# Altium schematic sheet MCU.SchDoc (part 2 of 3)
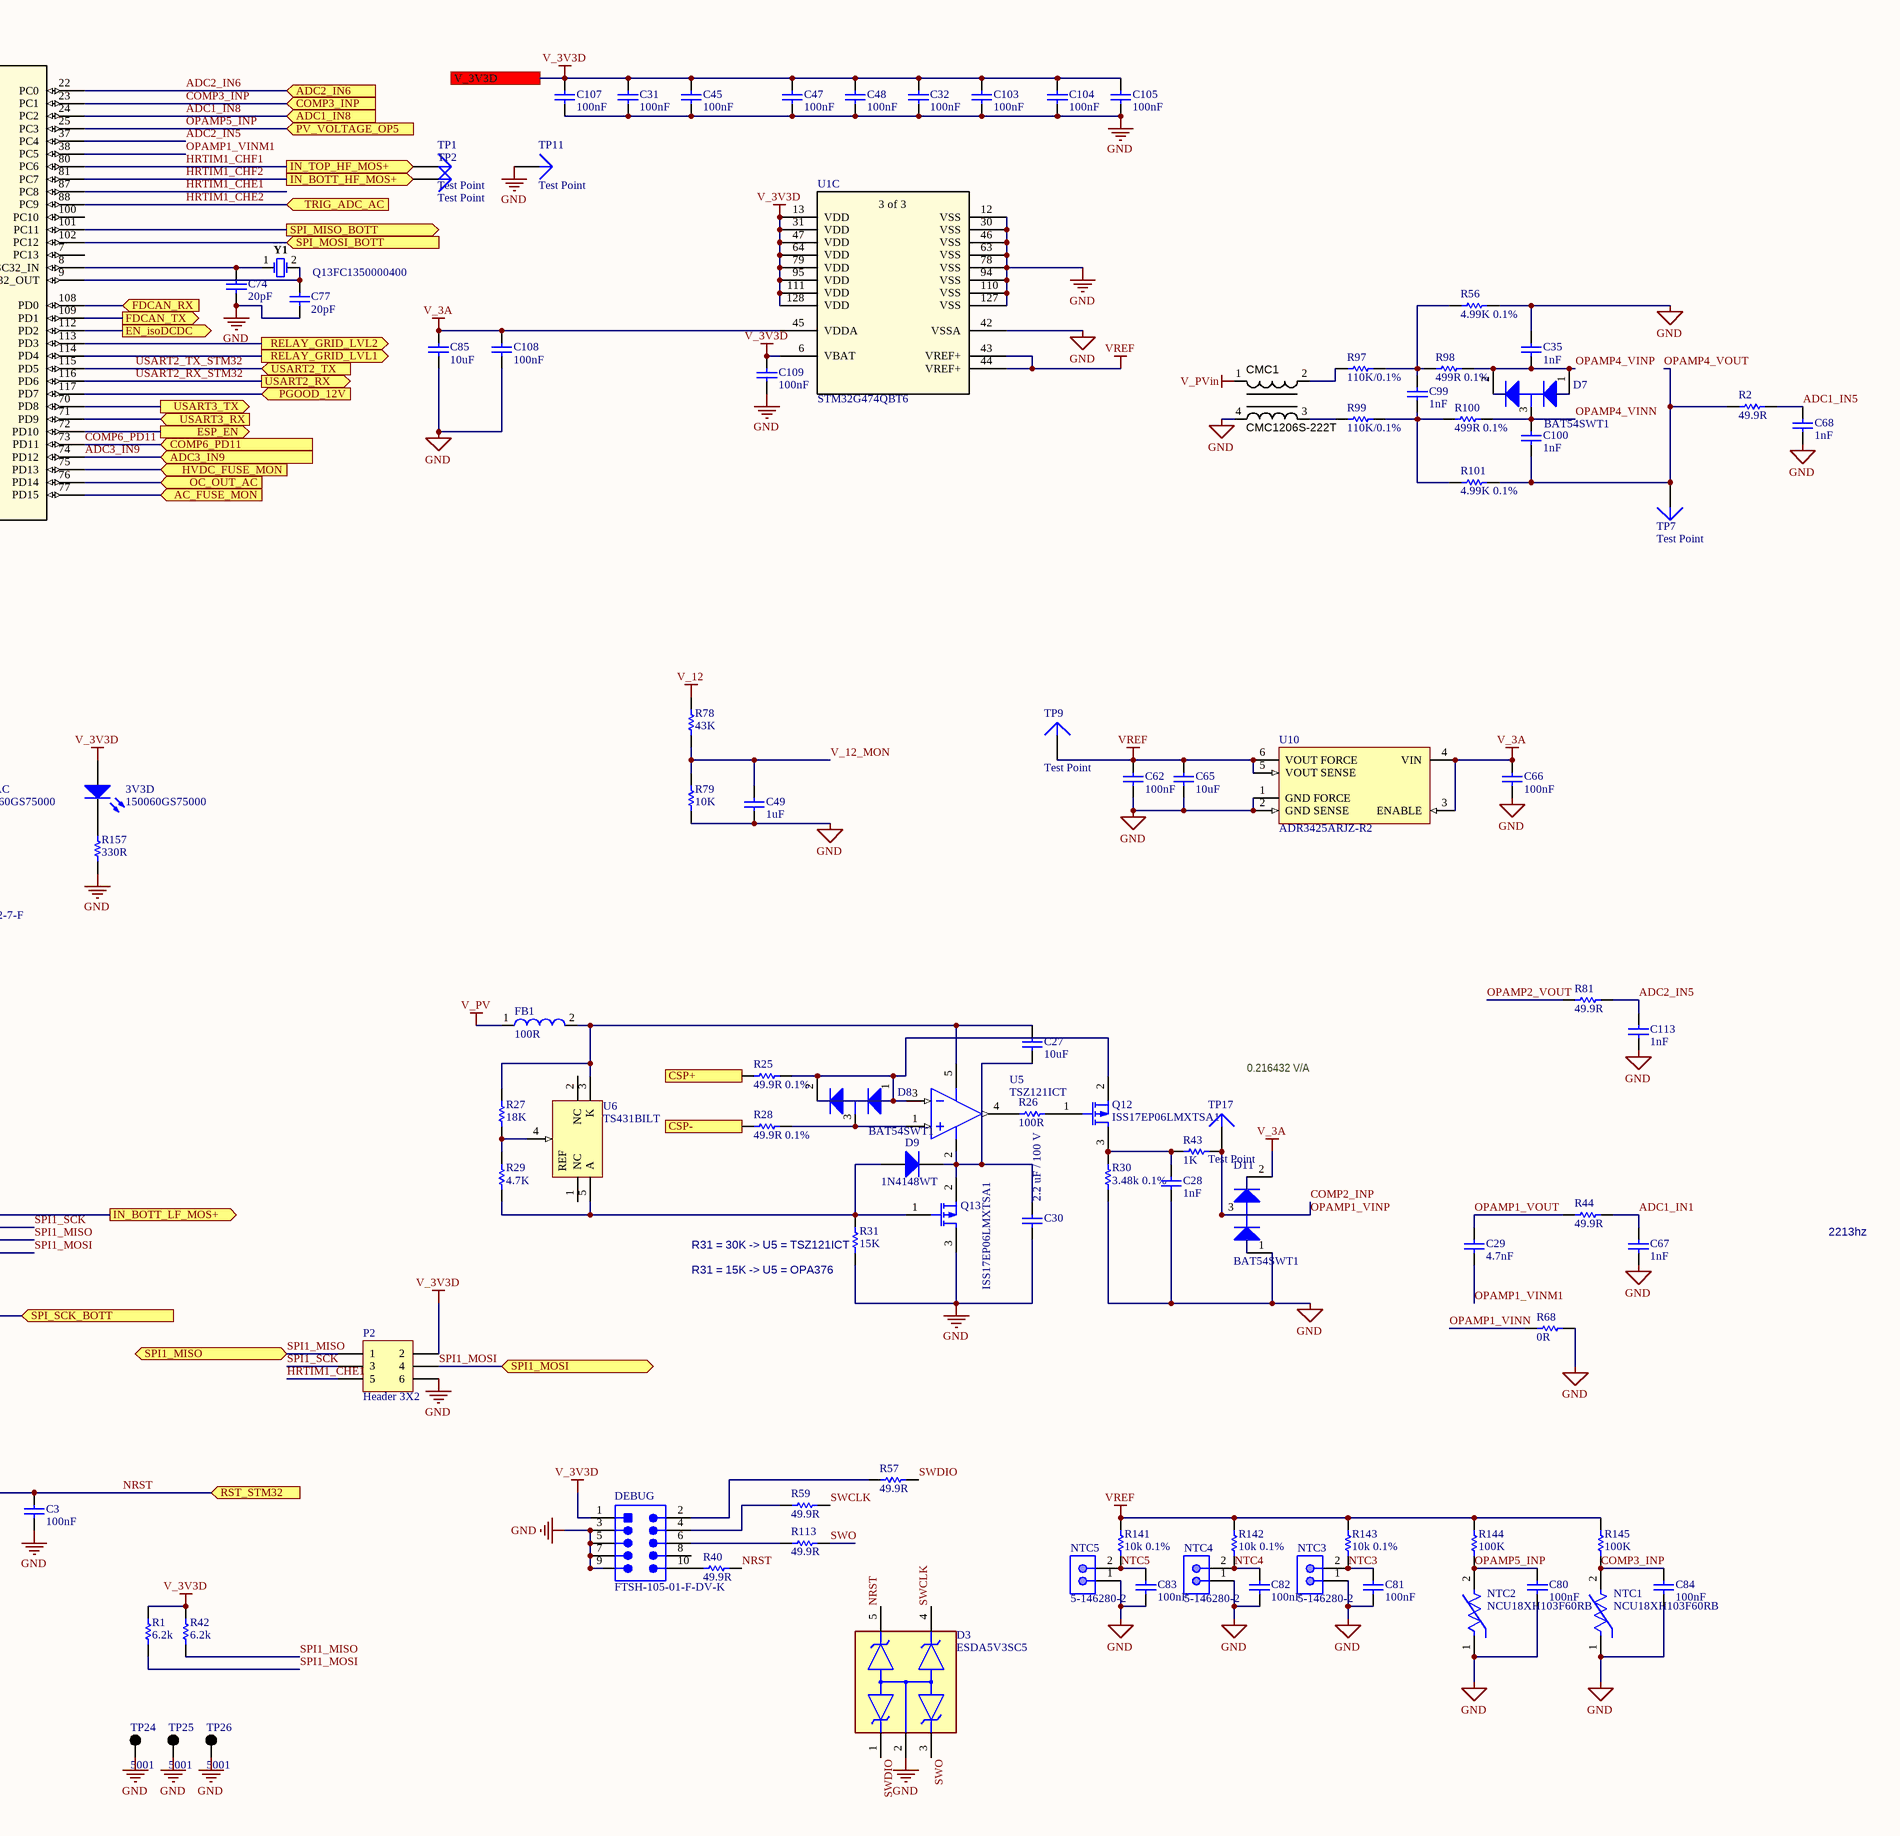
[diagram p2: MCU.SchDoc, right]
## Library data of the parts
3V3D DC/AC = CMP-1426-00002-1: SMD mono-color Chip LED, WL-SMCW, Green; Manufacturer: Wuerth Elektronik; ComponentLink1URL: http://www.we-online.com; ComponentLink2Description: Datasheet; Color: Green; ComponentLink2URL: http://katalog.we-online.com/led/datasheet/150060GS75000.pdf; PartNumber: 150060GS75000; PackageReference: 0603_A; ComponentLink1Description: Manufacturer URL; Parameter 1: *; JLCPCB Part #: *
C3 = CMP-2008-02743-1: X7R 100nF ±10% 16V 0402 Multilayer Ceramic Capacitors MLCC - SMD/SMT ROHS; Manufacturer: AVX Interconnect / Elco; Part Number: 04026D104KAT2A; Voltage Rating: 6.3V; Dielectric: X5R; Supplier 1: Newark; Supplier Part Number 1: 34M9214; Manufacturer Part Number: 04026D104KAT2A; RoHS: Yes; Category: Ceramic Capacitors; Stock 1: 1436; Pricing 1: 10=0.02800, 25=0.02300, 50=0.01800, 100=0.01200, 250=0.01100, 500=0.00900, 1000=0.00700 (USD); Mount: Surface Mount; Case/Package: 0402; Case Code (Metric): 1005; Case Code (Imperial): 0402; Contact Plating: Tin,Matte; Dielectric Material: Ceramic; Min Operating Temperature: -55°C; Max Operating Temperature: 85°C; Package Quantity: 1; Packaging: Tape and Reel; Capacitance: 100nF; Tolerance: 10%; Voltage Rating (DC): 6.3V; Voltage: 6.3V; Termination: SMD/SMT; Series: -; Construction: Flat; Length: 1mm; Width: 0.02inch; Height: 0.56mm; Thickness: 0.022inch; Depth: 0.5mm; Radiation Hardening: No; REACH SVHC: No SVHC; Lead Free: Lead Free; RoHS Compliant: Yes; Parameter 1: *; JLCPCB Part #: C1525
C27 C85 = CMP-2007-03395-1: X5R 25V ±10% 10uF 0805 Multilayer Ceramic Capacitors MLCC - SMD/SMT ROHS; Part Number: GRM21BR71A106KE51L; Manufacturer: Murata; Parameter 1: *; JLCPCB Part #: C15850
C28 C68 C99 C100 = CAP: X7R 1nF ±10% 50V 0603 Multilayer Ceramic Capacitors MLCC - SMD/SMT ROHS; Manufacturer: AVX Interconnect / Elco; Part Number: 06035A151JAT2A.; Manufacturer Part Number: 06035A151JAT2A; Capacitance: 100pF; Tolerance: 5%; Dielectric: C0G; Temperature Coefficient: 30ppm/°C; Insulation Resistance: 100GR; Supplier 1: Digi-Key; Supplier Part Number 1: 478-1177-1-ND; RoHS: Yes; Category: Ceramic Capacitors; Stock 1: 63714; Pricing 1: 1=0.12000, 10=0.08900, 100=0.04180, 500=0.02932, 1000=0.02428 (USD); Mount: Surface Mount,PCB; Case/Package: 0603; Number of Pins: 2; Case Code (Metric): 1608; Case Code (Imperial): 0603; Dielectric Material: Ceramic; Contact Plating: Tin,Matte; Min Operating Temperature: -55°C; Max Operating Temperature: 125°C; Voltage Rating (DC): 50V; Voltage Rating: 50V; Packaging: Tape and Reel; Package Quantity: 1; Termination: SMD/SMT; Voltage: 50V; Length: 1.6mm; Height: 0.86mm; Width: 0.032inch; Depth: 0.81mm; Thickness: 0.035inch; Radiation Hardening: No; Lead Free: Lead Free; REACH SVHC: No SVHC; ComponentLink1URL: https://datasheet.ciiva.com/1124/84496-1124721.pdf?src-supplier=Element14; ComponentLink1Description: https://datasheet.ciiva.com/1124/84496-1124721.pdf?src-supplier=Element14; ComponentLink2URL: https://datasheet.ciiva.com/2987/ccog-2987781.pdf?src-supplier=Avnet; ComponentLink2Description: https://datasheet.ciiva.com/2987/ccog-2987781.pdf?src-supplier=Avnet; ComponentLink3URL: https://datasheet.ciiva.com/7855/759117-7855061.pdf?src-supplier=Element14; ComponentLink3Description: https://datasheet.ciiva.com/7855/759117-7855061.pdf?src-supplier=Element14; ComponentLink4URL: https://datasheet.ciiva.com/2987/ccog-2987782.pdf?src-supplier=Avnet; ComponentLink4Description: https://datasheet.ciiva.com/2987/ccog-2987782.pdf?src-supplier=Avnet; ComponentLink5URL: https://datasheet.ciiva.com/156/ccog-156216.pdf?src-supplier=Digi-Key; ComponentLink5Description: https://datasheet.ciiva.com/156/ccog-156216.pdf?src-supplier=Digi-Key; ComponentLink6URL: https://datasheet.ciiva.com/156/ccog-156217.pdf?src-supplier=Digi-Key; ComponentLink6Description: https://datasheet.ciiva.com/156/ccog-156217.pdf?src-supplier=Digi-Key; ComponentLink7URL: https://datasheet.ciiva.com/156/ccog-156218.pdf?src-supplier=Digi-Key; ComponentLink7Description: https://datasheet.ciiva.com/156/ccog-156218.pdf?src-supplier=Digi-Key; ComponentLink8URL: https://datasheet.ciiva.com/16300/ccog-16300429.pdf?src-supplier=Future+Electronics; ComponentLink8Description: https://datasheet.ciiva.com/16300/ccog-16300429.pdf?src-supplier=Future+Electronics; ComponentLink9URL: https://datasheet.ciiva.com/22699/84496-22699966.pdf?src-supplier=Element14; ComponentLink9Description: https://datasheet.ciiva.com/22699/84496-22699966.pdf?src-supplier=Element14; ComponentLink10URL: https://datasheet.ciiva.com/5418/ccog-5418335.pdf?src-supplier=Mouser; ComponentLink10Description: https://datasheet.ciiva.com/5418/ccog-5418335.pdf?src-supplier=Mouser; ComponentLink11URL: https://datasheet.ciiva.com/16538/ccog-16538111.pdf?src-supplier=Avnet+Asia; ComponentLink11Description: https://datasheet.ciiva.com/16538/ccog-16538111.pdf?src-supplier=Avnet+Asia; Parameter 1: *; JLCPCB Part #: C1588
C29 = CMP-2000-07546-1: X7R ±10% 4.7nF 50V 0603 Multilayer Ceramic Capacitors MLCC - SMD/SMT ROHS; Manufacturer: TDK; Capacitance: 100nF; Package Reference: 603; Radiation Hardening: No; Composition: Ceramic; Datasheet URL: https://product.tdk.com/info/en/catalog/datasheets/mlcc_automotive_general_en.pdf; Mounting Technology: SurfaceMount; Datasheet Version: 12/2014; Width: 0.8mm; Length: 1.6mm; Voltage: 50V; Tolerance: 10%; Case Code (Imperial): 0603; RoHSCompliant: True; Min Operating Temperature: -55degC; Package Description: 2-Pin Surface Mount Device, Body 1.6 x 0.8 mm; Packaging: TapeandReel; Package Quantity: 1; Voltage Rating: 50V; Mount: SurfaceMount; Lead Free: LeadFree; Depth: 0.8mm; Termination: SMD/SMT; Case Code (Metric): 1608; Thickness: 0.035inch; Height: 0.8mm; Dielectric: X7R; Weight: 7.1E-05oz; Voltage Rating (DC): 50V; REACH SVHC: NoSVHC; Manufacturer URL: http://www.tdk.com/; Case/Package: 0603; Max Operating Temperature: 125degC; Parameter 1: *; JLCPCB Part #: C53987
C30 = CMP-2000-06053-1: Chip Capacitor, 2.2 uF, +/- 10%, -55 to 125 degC, 1210 (3225 Metric), RoHS, Tape and Reel; PCN Part Number: MLCCPartNumberChange30/Nov/2012; Manufacturer: TDK; Capacitance: 2.2µF; Catalog Drawings: CSERIES_1210_2.5; Product Training Modules: SEAT,CCV,andTVCLDesignToolsGuidetoReplacinganElectrolyticCapacitorwithanMLCC; Other Names: 445-4497-6; Voltage - Rated: 100V; Temperature Coefficient: X7R; Featured Product: C-SeriesMidVoltageMLCCs; Online Catalog: CSeries,MidVoltage; Ratings: -; Mounting Technology: SurfaceMount; Height - Seated (Max): -; Applications: GeneralPurpose; Packaging: Digi-Reel®; Mounting Type: SurfaceMount,MLCC; Lead Spacing: -; Thickness (Max): 0.098"(2.50mm); Package Reference: 1210 (3225 Metric); Manufacturer URL: http://www.tdk.com/; Size / Dimension: 0.126"Lx0.098"W(3.20mmx2.50mm); Operating Temperature: -55°C~125°C; Datasheet URL: https://datasheet.ciiva.com/15192/getdatasheetpartid-725361-15192330.pdf; RoHS Information: RoHSCertificate-MLCC; Lead Style: -; Standard Package: 1; Family: CeramicCapacitors; Datasheet Version: 10/2014; Category: Capacitors; Tolerance: ±10%; Features: -; Series: C; Package Description: 2-Pin Surface Mount Device, Body 3.2 x 2.5 mm; Package / Case: 1210(3225Metric); Parameter 1: *; JLCPCB Part #: *
C31 C32 C45 C47 C48 C66 C80-C84 C103-C105 C107-C109 = CAP: X7R 100nF ±10% 50V 0603 Multilayer Ceramic Capacitors MLCC - SMD/SMT ROHS; Part Number: GCM188R72A104KA64D; Manufacturer: Murata; Manufacturer Part Number: CC0603KRX7R9BB104; Voltage Rating: 100V; Supplier 1: Arrow Electronics; Supplier Part Number 1: GCM188R72A104KA64D; RoHS: Yes; Category: Ceramic Capacitors; Mount: Surface Mount; Case/Package: 0603; Case Code (Imperial): 0603; Case Code (Metric): 1608; Min Operating Temperature: -55°C; Max Operating Temperature: 125°C; Tolerance: 10%; Packaging: Tape and Reel; Capacitance: 100nF; Dielectric: X7R; Termination: SMD/SMT; Voltage Rating (DC): 100V; Length: 1.6mm; Height: 0.8mm; Depth: 0.8mm; Radiation Hardening: No; ComponentLink1URL: https://datasheet.ciiva.com/17451/product-17451047.pdf?src-supplier=Avnet+Europe; ComponentLink1Description: https://datasheet.ciiva.com/17451/product-17451047.pdf?src-supplier=Avnet+Europe; ComponentLink2URL: https://datasheet.ciiva.com/26889/getdatasheetpartid-387765-26889164.pdf?src-supplier=Verical; ComponentLink2Description: https://datasheet.ciiva.com/26889/getdatasheetpartid-387765-26889164.pdf?src-supplier=Verical; Parameter 1: *; JLCPCB Part #: C14663
C35 = CMP-2006-04245-1: X7R 1nF ±10% 50V 0603 Multilayer Ceramic Capacitors MLCC - SMD/SMT ROHS; Manufacturer: AVX Interconnect / Elco; Part Number: 06035A151JAT2A.; Manufacturer Part Number: 06035A151JAT2A; Capacitance: 100pF; Tolerance: 5%; Dielectric: C0G; Temperature Coefficient: 30ppm/°C; Insulation Resistance: 100GR; Supplier 1: Digi-Key; Supplier Part Number 1: 478-1177-1-ND; RoHS: Yes; Category: Ceramic Capacitors; Stock 1: 63714; Pricing 1: 1=0.12000, 10=0.08900, 100=0.04180, 500=0.02932, 1000=0.02428 (USD); Mount: Surface Mount,PCB; Case/Package: 0603; Number of Pins: 2; Case Code (Metric): 1608; Case Code (Imperial): 0603; Dielectric Material: Ceramic; Contact Plating: Tin,Matte; Min Operating Temperature: -55°C; Max Operating Temperature: 125°C; Voltage Rating (DC): 50V; Voltage Rating: 50V; Packaging: Tape and Reel; Package Quantity: 1; Termination: SMD/SMT; Voltage: 50V; Length: 1.6mm; Height: 0.86mm; Width: 0.032inch; Depth: 0.81mm; Thickness: 0.035inch; Radiation Hardening: No; Lead Free: Lead Free; REACH SVHC: No SVHC; ComponentLink1URL: https://datasheet.ciiva.com/1124/84496-1124721.pdf?src-supplier=Element14; ComponentLink1Description: https://datasheet.ciiva.com/1124/84496-1124721.pdf?src-supplier=Element14; ComponentLink2URL: https://datasheet.ciiva.com/2987/ccog-2987781.pdf?src-supplier=Avnet; ComponentLink2Description: https://datasheet.ciiva.com/2987/ccog-2987781.pdf?src-supplier=Avnet; ComponentLink3URL: https://datasheet.ciiva.com/7855/759117-7855061.pdf?src-supplier=Element14; ComponentLink3Description: https://datasheet.ciiva.com/7855/759117-7855061.pdf?src-supplier=Element14; ComponentLink4URL: https://datasheet.ciiva.com/2987/ccog-2987782.pdf?src-supplier=Avnet; ComponentLink4Description: https://datasheet.ciiva.com/2987/ccog-2987782.pdf?src-supplier=Avnet; ComponentLink5URL: https://datasheet.ciiva.com/156/ccog-156216.pdf?src-supplier=Digi-Key; ComponentLink5Description: https://datasheet.ciiva.com/156/ccog-156216.pdf?src-supplier=Digi-Key; ComponentLink6URL: https://datasheet.ciiva.com/156/ccog-156217.pdf?src-supplier=Digi-Key; ComponentLink6Description: https://datasheet.ciiva.com/156/ccog-156217.pdf?src-supplier=Digi-Key; ComponentLink7URL: https://datasheet.ciiva.com/156/ccog-156218.pdf?src-supplier=Digi-Key; ComponentLink7Description: https://datasheet.ciiva.com/156/ccog-156218.pdf?src-supplier=Digi-Key; ComponentLink8URL: https://datasheet.ciiva.com/16300/ccog-16300429.pdf?src-supplier=Future+Electronics; ComponentLink8Description: https://datasheet.ciiva.com/16300/ccog-16300429.pdf?src-supplier=Future+Electronics; ComponentLink9URL: https://datasheet.ciiva.com/22699/84496-22699966.pdf?src-supplier=Element14; ComponentLink9Description: https://datasheet.ciiva.com/22699/84496-22699966.pdf?src-supplier=Element14; ComponentLink10URL: https://datasheet.ciiva.com/5418/ccog-5418335.pdf?src-supplier=Mouser; ComponentLink10Description: https://datasheet.ciiva.com/5418/ccog-5418335.pdf?src-supplier=Mouser; ComponentLink11URL: https://datasheet.ciiva.com/16538/ccog-16538111.pdf?src-supplier=Avnet+Asia; ComponentLink11Description: https://datasheet.ciiva.com/16538/ccog-16538111.pdf?src-supplier=Avnet+Asia; Parameter 1: *; JLCPCB Part #: C1588
C49 = CAP-NP-2: X5R ±10% 50V 1uF 0603 Multilayer Ceramic Capacitors MLCC - SMD/SMT ROHS; Manufacturer: AVX; Rated Voltage: 10V; Capacitance: 1µF; Datasheet Version: 10/2007; Mounting Technology: SurfaceMount; Datasheet URL: https://datasheet.ciiva.com/11787/0900766b80a45521-11787469.pdf; Tolerance (%): ±10%; Package Description: 2-Pin Surface Mount Device, Body 1.6 x 0.81 mm; Case Size/Dimension: 0603; Package Reference: 0603; Manufacturer URL: http://www.avx.com/; Dielectric: X5R; Parameter 1: *; JLCPCB Part #: C15849
C59 C63 = CMP-2008-02583-1: C0G 6.8pF ±0.25pF 50V 0402 Multilayer Ceramic Capacitors MLCC - SMD/SMT ROHS; Manufacturer: AVX Interconnect / Elco; Part Number: 04025A150JAT2A; Parameter 1: *; JLCPCB Part #: C1576
C62 = CAP: X7R 100nF ±10% 16V 0402 Multilayer Ceramic Capacitors MLCC - SMD/SMT ROHS; Manufacturer: AVX Interconnect / Elco; Part Number: 04026D104KAT2A; Voltage Rating: 6.3V; Dielectric: X5R; Supplier 1: Newark; Supplier Part Number 1: 34M9214; Manufacturer Part Number: 04026D104KAT2A; RoHS: Yes; Category: Ceramic Capacitors; Stock 1: 1436; Pricing 1: 10=0.02800, 25=0.02300, 50=0.01800, 100=0.01200, 250=0.01100, 500=0.00900, 1000=0.00700 (USD); Mount: Surface Mount; Case/Package: 0402; Case Code (Metric): 1005; Case Code (Imperial): 0402; Contact Plating: Tin,Matte; Dielectric Material: Ceramic; Min Operating Temperature: -55°C; Max Operating Temperature: 85°C; Package Quantity: 1; Packaging: Tape and Reel; Capacitance: 100nF; Tolerance: 10%; Voltage Rating (DC): 6.3V; Voltage: 6.3V; Termination: SMD/SMT; Series: -; Construction: Flat; Length: 1mm; Width: 0.02inch; Height: 0.56mm; Thickness: 0.022inch; Depth: 0.5mm; Radiation Hardening: No; REACH SVHC: No SVHC; Lead Free: Lead Free; RoHS Compliant: Yes; Parameter 1: *; JLCPCB Part #: C1525
C65 = CAP-NP-2: X5R ±10% 10V 10uF 0603 Multilayer Ceramic Capacitors MLCC - SMD/SMT ROHS; Manufacturer: Samsung Electro-Mechanics; Manufacturer Part Number: CL10B104KB8NNNC; Capacitance: 0.1µF; Rated Voltage: 50V; Dielectric: X7R; Case Size/Dimension: 0603; Datasheet URL: https://datasheet.ciiva.com/29198/456651-da-01-en-vs-kondensator-0605-29198839.pdf; Manufacturer URL: http://www.samsungsem.com/global/index.jsp; Tolerance (%): ±10%; Datasheet Version: Nov-10; Supplier 1: Digi-Key; Supplier Part Number 1: 1276-1000-1-ND; RoHS: Yes; Category: Ceramic Capacitors; Stock 1: 13409690; Pricing 1: 1=0.10000, 10=0.03000, 50=0.01620, 100=0.01330, 500=0.00950, 1000=0.00746 (USD); Mount: Surface Mount; Case/Package: 0603; Case Code (Metric): 1608; Case Code (Imperial): 0603; Contact Plating: Tin; Material: Ceramic; Min Operating Temperature: -55°C; Max Operating Temperature: 125°C; Voltage Rating: 50V; Package Quantity: 1; Packaging: Tape and Reel; Tolerance: 10%; Voltage Rating (DC): 50V; Voltage: 50V; Series: CL; Construction: Flat; Length: 1.6mm; Width: 0.031inch; Height: 0.8mm; Depth: 0.8mm; Thickness: 0.035inch; Radiation Hardening: No; Lead Free: Lead Free; RoHS Compliant: Yes; ComponentLink1URL: https://datasheet.ciiva.com/25803/cl10b104kb8nnnc-25803393.pdf?src-supplier=Digi-Key; ComponentLink1Description: https://datasheet.ciiva.com/25803/cl10b104kb8nnnc-25803393.pdf?src-supplier=Digi-Key; ComponentLink2URL: https://datasheet.ciiva.com/26838/getdatasheetpartid-89097-26838411.pdf?src-supplier=Verical; ComponentLink2Description: https://datasheet.ciiva.com/26838/getdatasheetpartid-89097-26838411.pdf?src-supplier=Verical; ComponentLink3URL: https://datasheet.ciiva.com/29198/456651-da-01-en-vs-kondensator-0605-29198839.pdf?src-supplier=Conrad; ComponentLink3Description: https://datasheet.ciiva.com/29198/456651-da-01-en-vs-kondensator-0605-29198839.pdf?src-supplier=Conrad; Parameter 1: *; JLCPCB Part #: C19702
C67 C113 = CMP-2008-02701-1: X7R 1nF ±10% 50V 0402 Multilayer Ceramic Capacitors MLCC - SMD/SMT ROHS; Manufacturer: AVX Interconnect / Elco; Part Number: 04025C102MAT2A; Tolerance: 20%; Supplier 1: Digi-Key; Supplier Part Number 1: 478-5130-1-ND; Manufacturer Part Number: 04025C102MAT2A; RoHS: Yes; Category: Ceramic Capacitors; Stock 1: 32316; Pricing 1: 1=0.10000, 10=0.03300, 50=0.01800, 100=0.01470, 500=0.01046, 1000=0.00822, 2500=0.00748, 5000=0.00688 (USD); Mount: Surface Mount; Case/Package: 0402; Case Code (Metric): 1005; Case Code (Imperial): 0402; Min Operating Temperature: -55°C; Max Operating Temperature: 125°C; Capacitance: 1nF; Voltage Rating: 50V; Packaging: Tape and Reel; Package Quantity: 1; Voltage Rating (DC): 50V; Dielectric: X7R; Voltage: 50V; Series: -; Termination: SMD/SMT; Construction: Flat; Length: 1mm; Width: 0.02inch; Height: 0.56mm; Thickness: 0.022inch; Depth: 0.5mm; Radiation Hardening: No; RoHS Compliant: Yes; Lead Free: Lead Free; REACH SVHC: No SVHC; ComponentLink1URL: https://datasheet.ciiva.com/11787/0900766b80dc2409-11787048.pdf?src-supplier=RSComponents; ComponentLink1Description: https://datasheet.ciiva.com/11787/0900766b80dc2409-11787048.pdf?src-supplier=RSComponents; ComponentLink2URL: https://datasheet.ciiva.com/150/cx7r-150278.pdf?src-supplier=Digi-Key; ComponentLink2Description: https://datasheet.ciiva.com/150/cx7r-150278.pdf?src-supplier=Digi-Key; ComponentLink3URL: https://datasheet.ciiva.com/5424/cx7r-218113-5424822.pdf?src-supplier=Mouser; ComponentLink3Description: https://datasheet.ciiva.com/5424/cx7r-218113-5424822.pdf?src-supplier=Mouser; ComponentLink4URL: https://datasheet.ciiva.com/150/cx7r-150279.pdf?src-supplier=Digi-Key; ComponentLink4Description: https://datasheet.ciiva.com/150/cx7r-150279.pdf?src-supplier=Digi-Key; ComponentLink5URL: https://datasheet.ciiva.com/150/cx7r-150280.pdf?src-supplier=Digi-Key; ComponentLink5Description: https://datasheet.ciiva.com/150/cx7r-150280.pdf?src-supplier=Digi-Key; ComponentLink6URL: https://datasheet.ciiva.com/16327/cx7r-16327672.pdf?src-supplier=Future+Electronics; ComponentLink6Description: https://datasheet.ciiva.com/16327/cx7r-16327672.pdf?src-supplier=Future+Electronics; ComponentLink7URL: https://datasheet.ciiva.com/1123/1679506-1123707.pdf?src-supplier=Element14; ComponentLink7Description: https://datasheet.ciiva.com/1123/1679506-1123707.pdf?src-supplier=Element14; ComponentLink8URL: https://datasheet.ciiva.com/1123/1679506-1123708.pdf?src-supplier=Element14; ComponentLink8Description: https://datasheet.ciiva.com/1123/1679506-1123708.pdf?src-supplier=Element14; ComponentLink9URL: https://datasheet.ciiva.com/11510/cx7r-11510958.pdf?src-supplier=Avnet; ComponentLink9Description: https://datasheet.ciiva.com/11510/cx7r-11510958.pdf?src-supplier=Avnet; ComponentLink10URL: https://datasheet.ciiva.com/16623/cx7r-16623374.pdf?src-supplier=Avnet+Europe; ComponentLink10Description: https://datasheet.ciiva.com/16623/cx7r-16623374.pdf?src-supplier=Avnet+Europe; Parameter 1: *; JLCPCB Part #: C1523
C74 C77 = CMP-2008-03945-1: C0G 20pF ±5% 50V 0402 Multilayer Ceramic Capacitors MLCC - SMD/SMT ROHS; Part Number: 0402CG200J500NT; Manufacturer: Murata; Parameter 1: *; JLCPCB Part #: C1554
C126 C127 = CMP-2006-02595-1: C0G ±5% 50V 100pF 0603 Multilayer Ceramic Capacitors MLCC - SMD/SMT ROHS; Part Number: GRM1885C1H101JA01D; Manufacturer: Murata; Temperature Coefficient: 30ppm/°C; Insulation Resistance: 10GR; Supplier 1: Digi-Key; Supplier Part Number 1: 490-1427-1-ND; Manufacturer Part Number: GRM1885C1H101JA01D; RoHS: Yes; Category: Ceramic Capacitors; Stock 1: 98306; Pricing 1: 1=0.10000, 10=0.06100, 50=0.03320, 100=0.02700, 500=0.01932, 1000=0.01518 (USD); Mount: Surface Mount; Case/Package: 0603; Number of Pins: 2; Case Code (Metric): 1608; Case Code (Imperial): 0603; Dielectric Material: Ceramic; Weight: 7.1E-05oz; Material: Ceramic; Min Operating Temperature: -55°C; Max Operating Temperature: 125°C; Capacitance: 100pF; Voltage Rating: 50V; Tolerance: 5%; Packaging: Tape and Reel; Package Quantity: 1; Voltage Rating (DC): 50V; Dielectric: C0G; Termination: SMD/SMT; Voltage: 50V; Length: 1.6mm; Width: 0.031inch; Height: 0.8mm; Thickness: 0.035inch; Depth: 0.8mm; Radiation Hardening: No; RoHS Compliant: Yes; REACH SVHC: Unknown; Lead Free: Lead Free; ComponentLink1URL: https://datasheet.ciiva.com/131/product-131088.pdf?src-supplier=Digi-Key; ComponentLink1Description: https://datasheet.ciiva.com/131/product-131088.pdf?src-supplier=Digi-Key; ComponentLink2URL: https://datasheet.ciiva.com/18100/getdatasheetpartid-26823-18100641.pdf?src-supplier=Verical; ComponentLink2Description: https://datasheet.ciiva.com/18100/getdatasheetpartid-26823-18100641.pdf?src-supplier=Verical; ComponentLink3URL: https://datasheet.ciiva.com/3777/grm1885c1h101ja0123-3777264.pdf?src-supplier=Arrow+Electronics; ComponentLink3Description: https://datasheet.ciiva.com/3777/grm1885c1h101ja0123-3777264.pdf?src-supplier=Arrow+Electronics; ComponentLink4URL: https://datasheet.ciiva.com/29149/450134-da-01-en-vs-kondensator-0603-29149008.pdf?src-supplier=Conrad; ComponentLink4Description: https://datasheet.ciiva.com/29149/450134-da-01-en-vs-kondensator-0603-29149008.pdf?src-supplier=Conrad; ComponentLink5URL: https://datasheet.ciiva.com/131/partnumbering-e-01-131089.pdf?src-supplier=Digi-Key; ComponentLink5Description: https://datasheet.ciiva.com/131/partnumbering-e-01-131089.pdf?src-supplier=Digi-Key; ComponentLink6URL: https://datasheet.ciiva.com/11605/c02e-11605557.pdf?src-supplier=Avnet; ComponentLink6Description: https://datasheet.ciiva.com/11605/c02e-11605557.pdf?src-supplier=Avnet; ComponentLink7URL: https://datasheet.ciiva.com/28556/4360-28556551.pdf?src-supplier=Element14; ComponentLink7Description: https://datasheet.ciiva.com/28556/4360-28556551.pdf?src-supplier=Element14; ComponentLink8URL: https://datasheet.ciiva.com/7828/4360-7828889.pdf?src-supplier=Element14; ComponentLink8Description: https://datasheet.ciiva.com/7828/4360-7828889.pdf?src-supplier=Element14; ComponentLink9URL: https://datasheet.ciiva.com/7828/4360-7828890.pdf?src-supplier=Element14; ComponentLink9Description: https://datasheet.ciiva.com/7828/4360-7828890.pdf?src-supplier=Element14; ComponentLink10URL: https://datasheet.ciiva.com/7828/4360-7828891.pdf?src-supplier=Element14; ComponentLink10Description: https://datasheet.ciiva.com/7828/4360-7828891.pdf?src-supplier=Element14; ComponentLink11URL: https://datasheet.ciiva.com/14116/grmseries-tc-hitype-eng-14116828.pdf?src-supplier=Distrelec; ComponentLink11Description: https://datasheet.ciiva.com/14116/grmseries-tc-hitype-eng-14116828.pdf?src-supplier=Distrelec; ComponentLink12URL: https://datasheet.ciiva.com/16291/product-16291613.pdf?src-supplier=Future+Electronics; ComponentLink12Description: https://datasheet.ciiva.com/16291/product-16291613.pdf?src-supplier=Future+Electronics; ComponentLink13URL: https://datasheet.ciiva.com/131/partnumbering-e-01-131087.pdf?src-supplier=Digi-Key; ComponentLink13Description: https://datasheet.ciiva.com/131/partnumbering-e-01-131087.pdf?src-supplier=Digi-Key; ComponentLink14URL: https://datasheet.ciiva.com/14116/grmseries-tc-hitype-eng-14116815.pdf?src-supplier=Distrelec; ComponentLink14Description: https://datasheet.ciiva.com/14116/grmseries-tc-hitype-eng-14116815.pdf?src-supplier=Distrelec; Parameter 1: *; JLCPCB Part #: C14858
CMC1 = CMC_2K2_100M_3216-SMD: Common Mode Choke 2.2K Ohm 1206 SMD; Manufacturer 1: Wurth Electronics Inc; Manufacturer Part Number 1: 744232222; Impedance: 2200 Ohm at 100 MHz; Ratings: 2.2k Ohms at 100MHz; SCDType: source; PackageDescription: SMD Inductor, 4-Leads, Body 1.8 x 3.4 mm; Supplier 1: Digi-Key; Supplier Part Number 1: 732-1474-1-ND; ComponentLink1URL: http://katalog.we-online.de/kataloge/eisos/media/pdf/744232222.pdf; ComponentLink1Description: 744232222 datasheet; Package / Case: Horizontal, 4 PC Pad; Height (Max): 0.083" (2.10mm)
D3 = CMP-12225-000010-1: TVS DIODE 3V SOT323-5; Manufacturer Part Number: ESDA6V1W5; Manufacturer: STMicroelectronics; Value: 90pF; Max Junction Temp: +125°C; Breakdown Voltage: 6.1V; Standoff Height: 0mm; Number Of Channels: 2; Peak Pulse Power: 150W; Direction: Unidirectional; Temperature Range Low: -40°C; Temperature Range High: +125°C; Octopart: https://octopart.com/esda6v1w5-stmicroelectronics-39557953; Device Class L1: Circuit Protection; Digikey Description: TVS DIODE 3V SOT323-5; Mouser Description: TVS Diodes / ESD Suppressors 6.1V 150W Unidirect; Capacitance: 90pF; Device Class L2: TVS Diodes; Reverse Standoff Voltage: 3V; Category: Diode; Ipc Land Pattern Name: SOT65P210X95-5; Lead Free: Yes; ComponentLink2Description: Datasheet; Height: 1.1mm; Temperature: -40°C to +125°C; Package: SOT323-5L; Device Class L3: unset; RoHS: TRUE; ComponentLink2URL: https://www.st.com/resource/en/datasheet/esdaxxxwx.pdf; Automotive: No; Parameter 1: *; JLCPCB Part #: *
D7 D8 D11 = CMP-1055-00560-1: Dual Series Schottky Barrier Diodes, 3-Pin SOT-323, Tape and Reel; Manufacturer: On Semiconductor; IFSM Max (A): 0.6; trr Max (ns): 5; ComponentLink3Description: Package Specification; RoHS: FALSE; ComponentLink1URL: http://www.onsemi.com/; PartNumber: BAT54SWT1; ComponentLink1Description: Manufacturer URL; Packing: Tape and Reel; PackageReference: SOT-323-3-419-04; ComponentLink2URL: http://www.onsemi.cn/pub_link/Collateral/BAT54SWT1-D.PDF; ComponentLink2Description: Datasheet; PackageDescription: 3-Pin Small Outline Transistor, Body 2 x 1.25 mm, Pitch 0.65 mm; Configuration: Dual; ComponentLink3URL: http://www.onsemi.com/pub_link/Collateral/419-04.PDF; Mounting Technology: Surface Mount; PackageVersion: Rev. N, 11/2008; DatasheetVersion: Rev. 10; Parameter 1: *; JLCPCB Part #: *
D9 = CMP-0881-00001-1: High Conductance Fast Switching Diode, 75 V, -55 to 150 degC, 2-Pin SOD523F, RoHS; Manufacturer: Fairchild Semiconductor; IR (VR: 75 V)=5 uA Max.; VF: 1 V Max.; BVR (IR: 5 uA)=75 V Min.; CO: 4 pF Max.; DatasheetVersion: Rev. A2; ComponentLink1Description: Manufacturer URL; PackageDescription: 2-Pin Surface Mount Device, Body 1.2 x 0.8 mm, Height 0.7 mm; ComponentLink2URL: http://www.fairchildsemi.com/ds/1N/1N4148WT.pdf; ComponentLink2Description: Datasheet; PartNumber: 1N4148WT; ComponentLink1URL: http://www.fairchildsemi.com/; Temperature Range: -55 to 150 degC; Mounting Technology: Surface Mount; PackageReference: SOD-523F-2; RoHS: TRUE; Parameter 1: *; JLCPCB Part #: *
DC/DC = CMP-1426-00005-1: SMD mono-color Chip LED, WL-SMCW, Yellow; Manufacturer: Wuerth Elektronik; Dominant Wavelength: 590nm; Viewing Angle: 140°; Lens Style: Clear,Rectangular; Luminous Intensity: 120mcd; Forward Voltage: 2V; Forward Current: 30mA; Test Current: 20mA; ComponentLink1URL: http://www.we-online.com; PartNumber: 150060YS75000; Color: Yellow; ComponentLink2Description: Datasheet; ComponentLink2URL: http://katalog.we-online.com/led/datasheet/150060YS75000.pdf; ComponentLink1Description: Manufacturer URL; PackageReference: 0603_A; Supplier 1: Digi-Key; Supplier Part Number 1: 732-4981-1-ND; Manufacturer Part Number: 150060YS75000; RoHS: Yes; Category: LEDs; Stock 1: 139; Pricing 1: 1=0.14000, 50=0.13300, 100=0.11400, 500=0.09900 (USD); Mount: Surface Mount; Case/Package: 0603; Case Code (Imperial): 0603; Case Code (Metric): 1608; Min Operating Temperature: -40°C; Max Operating Temperature: 85°C; Packaging: Tape and Reel; Package Quantity: 4000; Wavelength: 590nm; Length: 1.6mm; Height: 0.7mm; Width: 0.8mm; REACH SVHC: Unknown; ComponentLink3URL: https://datasheet.ciiva.com/23843/150060ys75000-23843250.pdf?src-supplier=Newark; ComponentLink3Description: https://datasheet.ciiva.com/23843/150060ys75000-23843250.pdf?src-supplier=Newark; ComponentLink4URL: https://datasheet.ciiva.com/29279/759432-da-01-en-chipled-0603-w-kl-gelb-150060ys75000-29279206.pdf?src-supplier=Conrad; ComponentLink4Description: https://datasheet.ciiva.com/29279/759432-da-01-en-chipled-0603-w-kl-gelb-150060ys75000-29279206.pdf?src-supplier=Conrad; ComponentLink5URL: https://datasheet.ciiva.com/29563/150060ys75000-29563045.pdf?src-supplier=Digi-Key; ComponentLink5Description: https://datasheet.ciiva.com/29563/150060ys75000-29563045.pdf?src-supplier=Digi-Key; ComponentLink6URL: https://datasheet.ciiva.com/22656/1911348-22656951.pdf?src-supplier=Element14; ComponentLink6Description: https://datasheet.ciiva.com/22656/1911348-22656951.pdf?src-supplier=Element14; ComponentLink7URL: https://datasheet.ciiva.com/29563/150060ys75000-29563033.pdf?src-supplier=Digi-Key; ComponentLink7Description: https://datasheet.ciiva.com/29563/150060ys75000-29563033.pdf?src-supplier=Digi-Key; ComponentLink8URL: https://datasheet.ciiva.com/48430/150060ys75000-eng-tds-48430044.pdf?src-supplier=Distrelec; ComponentLink8Description: https://datasheet.ciiva.com/48430/150060ys75000-eng-tds-48430044.pdf?src-supplier=Distrelec; Parameter 1: *; JLCPCB Part #: *
DEBUG = CMP-2000-05352-1: Male Header, Pitch 1.27 mm, 2 x 5 Position, Height 6.12 mm, RoHS, Tube; Manufacturer: Samtec; Number of Positions: 10; Connector Type: Header,Shrouded; Number of Positions Loaded: All; Row Spacing: 0.050"(1.27mm); Fastening Type: -; Package Reference: FTSH-105-01-L-DV-K; Termination: Solder; Package URL: http://suddendocs.samtec.com/prints/ftsh-1xx-xx-xxx-dv-xxx-footprint.pdf; Number of Rows: 2; Contact Finish Thickness: 3µin(0.08µm); Contact Type: MalePin; Manufacturer URL: http://www.samtec.com/; Contact Mating Length: 0.120"(3.05mm); Pitch: 0.050"(1.27mm); Series: FTSH; Features: -; Contact Finish: Gold; Color: Black; Family: RectangularConnectors-Headers,MalePins; Datasheet URL: http://suddendocs.samtec.com/prints/ftsh-1xx-xx-xxx-dv-xxx-mkt.pdf; Package Description: Male Header, Pitch 1.27 mm, 2 x 5 Position, Height 5.97 mm, Tail Length 4.32 mm; Mounting Type: SurfaceMount; Datasheet Version: Rev. ET, 10/1995; Category: Connectors,Interconnects; Packaging: Tube; Parameter 1: *; JLCPCB Part #: *
FB1 = CMP-0220-00115-1: SMD EMI Suppression Ferrite Bead WE-CBF, Z = 1500 Ohm; DatasheetVersion: Dec-2005; ComponentLink1URL: http://www.we-online.com; PackageVersion: 2009; PackageDescription: Chip Inductor, 2-Leads, Body 1.6 x 0.8 mm; ComponentLink2URL: http://www.we-online.de/katalog/media/pdf/742792691.pdf; ComponentLink1Description: Manufacturer Link; ComponentLink2Description: Datasheet; Impedance: 1500 Ohm; PackageReference: SMD-0603; Parameter 1: *; JLCPCB Part #: *
NTC1 NTC2 = CMP-06022-000443-2: THERMISTOR NTC; Max Operating Temperature: 125°C; REACH SVHC: No SVHC; Case/Package: 0603; Min Operating Temperature: -40°C; RoHS Compliant: Yes; Case Code (Imperial): 0603; Case Code (Metric): 1608; Parameter 1: *; JLCPCB Part #: *
NTC3-NTC5 = CMP-2000-07492-1: Male Header, Pitch 2.54 mm, 1 x 2 Position, Height 8.21 mm, Tail Length 3.05 mm, -65 to 105 degC, RoHS, Bulk; Manufacturer: TE Connectivity; Mating Connector Lock: No(Without); Number of Positions: 2; Pitch: 2.54mm; PCB Mounting Orientation: Vertical; Keyed: No; Case\/Package: 100; Mating Post Length: 0.23inch; High Temperature Housing: Yes; Max Current Rating: 5A; PCB Thickness: 0.063inch; PCB Mount Retention: Without; Approvals: CSA; Current Rating: 3A; Radiation Hardening: No; Length: 4.67mm; Contact Mating Length: 0.23inch; Connector Type: Header; Number of Rows: 1; Termination Post Length: 0.12inch; Board Standoff: No(Without); Max Operating Temperature: 105degC; Contact Shape: Square; Selectively Loaded: No(Without); Gasket: No(Without); Number of Contacts: 2; Contact Gender: Male; Mating Alignment: No(Without); Manufacturer URL: http://www.te.com/; Datasheet URL: http://www.te.com/commerce/DocumentDelivery/DDEController?Action=showdoc&DocId=Customer+Drawing%7F146280%7FH1%7Fpdf%7FEnglish%7FENG_CD_146280_H1.pdf%7F5-146280-2; Mount: ThroughHole; Orientation: Straight; Packaging: Carton; Package Reference: 5-146280-2; Package Quantity: 500; Stabilizers: No(Without); Row Spacing: 2.54mm; Contact Material: CopperAlloy; Panel Mount Retention: No(Without); Datasheet Version: Rev. H1, 08/2016; Housing Colour: Black; Colour: Black; Package Description: Male Header, Pitch 2.54 mm, 1 x 2 Position, Height 8.21 mm, Tail Length 3.05 mm; Contact Plating: Matte; Housing Material: Polymer; Contact Protection: No(Without); Min Operating Temperature: -65degC; Mounting Technology: ThroughHole; Flammability Rating: UL94V-0; RoHSCompliant: true; Termination: ThroughHole; Depth: 2.34mm; High Speed Serial Data Connector: No; Parameter 1: *; JLCPCB Part #: *
P2 = Header 3X2: Header, 3-Pin, Dual row; LatestRevisionDate: 17-Jul-2002; LatestRevisionNote: Re-released for DXP Platform.; Publisher: Altium Limited; Parameter 1: *; JLCPCB Part #: *
Q12 Q13 = CMP-1099-00031-1: P-Channel SIPMOS Small-Signal-Transistor, -60 V VDS, -0.33 A ID, -55 to 150 degC, PG-SOT23, Reel, Green; Manufacturer: Infineon; PartNumber: BSS83P; RDS (on) (max): 2,000Â mOhm; VGS(th) (min): -1Â V; VDS (max): -60Â V; VGS(th) (max): -2Â V; IDpuls (max): -1.32Â A; Green: TRUE; ID (max): -0.33Â A; QG: 2.38Â nC; Rth: 350Â K/W; RDS (on) (max) (@4.5V): 3,000Â mOhm; Pto t (max): 0.36Â W; PackageDescription: 3-Pin Small Outline Transistor Package, 2.9 x 1.3 mm Body, 0.95 mm Pitch; ComponentLink1Description: Manufacturer URL; Packing: Reel; Mounting Technology: Surface Mount; ComponentLink1URL: http://www.infineon.com/; ComponentLink3Description: Package Specification; PackageReference: PG-SOT23; Halogen-free: TRUE; ComponentLink3URL: http://www.infineon.com/dgdl/SOT23-Package_Overview.pdf?folderId=db3a30431936bc4b0119532290053c66&fileId=db3a30431936bc4b0119533468123c85; ComponentLink2Description: Datasheet; ComponentLink2URL: http://www.infineon.com/dgdl/BSS83P_Rev1.5.pdf?folderId=db3a3043156fd5730115d6a107c41454&fileId=db3a304330f686060131045ae20e3ea3; PackageVersion: Apr-08; DatasheetVersion: Rev. 1.5; Parameter 1: *; JLCPCB Part #: *
Q15 Q16 = CMP-2000-04929-1: N-Channel Enhancement Mode Field Effect Transistor, 60 V, 0.115 A, -55 to 150 degC, 3-Pin SOT23, RoHS, Tape and Reel; Id - Continuous Drain Current: 115mA; Typical Turn-On Delay Time: 7ns; Typical Turn-Off Delay Time: 11ns; Brand: DiodesIncorporated; Transistor Type: 1N-Channel; Vgs - Gate-Source Voltage: 20V; Rise Time: 3ns; Configuration: Single; Fall Time: 5.6ns; Vds - Drain-Source Breakdown Voltage: 70V; Rds On - Drain-Source Resistance: 7.5Ohms; Number of Channels: 1Channel; Forward Transconductance - Min: 0.08S; Pd - Power Dissipation: 300mW; Unit Weight: 0.000282oz; Datasheet URL: http://datasheet.octopart.com/2N7002-7-F-Diodes-Inc.-datasheet-8326113.pdf; Width: 1.3mm; Series: 2N7002; Length: 2.9mm; Product Category: MOSFET; Minimum Operating Temperature: -55C; Manufacturer URL: http://www.diodes.com/; Mounting Style: SMD/SMT; Package Reference: SOT23-3; Package Description: 3-Pin Small Outline Transistor, Body 2.9 x 1.3 mm, Pitch 0.96 mm; Maximum Operating Temperature: +150C; Transistor Polarity: N-Channel; Factory Pack Quantity: 3000; Technology: Si; Channel Mode: Enhancement; Datasheet Version: Rev. 21-2, 02/2009; Type: EnhancementModeFieldEffectTransistor; RoHS: True; Packaging: Reel; Package / Case: SOT-23-3; Height: 1mm; Product: MOSFETSmallSignal; Manufacturer: DiodesIncorporated; Parameter 1: *; JLCPCB Part #: C8545
R1 R42 = CMP-2100-03667-1: Chip Resistor, 0 Ohm, +/- 5%, 0.1 W, -55 to 155 degC, 0603 (1608 Metric), RoHS, Tape and Reel; Manufacturer: Yageo; Temperature Coefficient: 200ppm/degreesC; Voltage Rating: 50V; Power Rating: 100mW; Resistance: 0mOhm; Width: 0.8mm; Max Operating Temperature: 155degC; Tolerance: 5%; Package Reference: 0603; Height: 0.45mm; Depth: 0.8mm; Package Description: 2-Pin Surface Mount Device, Body 1.6 x 0.8 mm; Termination: SMD/SMT; Package Quantity: 5000; Case/Package: 0603; Case Code (Imperial): 0603; Radiation Hardening: No; Number of Pins: 2; Length: 1.6mm; Lead Free: LeadFree; Voltage Rating (DC): 50V; Military Standard: Not; Datasheet URL: http://www.yageo.com/NewPortal/yageodocoutput?fileName=/pdf/R-Chip/PYu-RC_Group_51_RoHS_L_5.pdf; Manufacturer URL: http://www.yageo.com/; Packaging: TapeandReel; Case Code (Metric): 1608; Min Operating Temperature: -55degC; Composition: ThickFilm; RoHSCompliant: true; Contact Plating: Tin; Datasheet Version: Rev. 5, 10/2016; REACH SVHC: NoSVHC; Parameter 1: *; JLCPCB Part #: *
R2 R40 R44 R57 R59 R113 = RES: ±1% ±200ppm/℃ 0.1W 49.9Ω 0603 Chip Resistor - Surface Mount ROHS; Manufacturer: Panasonic; Part Number: ERJ-3EKF49R9V; Manufacturer Part Number: ERJ3EKF49R9V; Power Rating: 100mW; Voltage Rating: 75V; Temperature Coefficient: 100ppm/°C; Voltage Rating (DC): 50V; Working Voltage: 6V; Supplier 1: RSComponents; Supplier Part Number 1: 1229343; RoHS: Yes; Category: Chip SMD Resistors; Stock 1: 1; Pricing 1: 5000=0.00700 (USD); Mount: Surface Mount; Case/Package: 0603; Case Code (Imperial): 0603; Case Code (Metric): 1608; Contact Plating: Tin; Min Operating Temperature: -55°C; Max Operating Temperature: 155°C; Packaging: Tape and Reel; Resistance: 49.9R; Tolerance: 1%; Resistor Type: Thick Film; Number of Terminations: 2; Termination: SMD/SMT; Max Power Dissipation: 100mW; Series: ERJ; Package Quantity: 5000; Resistance Tolerance: 1%; Features: Automotive AEC-Q200; Construction: Rectangular; Technology: THICK FILM; Length: 1.6mm; Width: 0.8mm; Height: 0.022inch; Depth: 0.8mm; Radiation Hardening: No; REACH SVHC: Unknown; Lead Free: Lead Free; RoHS Compliant: Yes; Military Standard: Not; ComponentLink1URL: https://datasheet.ciiva.com/46388/1678782-46388908.pdf?src-supplier=Element14; ComponentLink1Description: https://datasheet.ciiva.com/46388/1678782-46388908.pdf?src-supplier=Element14; ComponentLink2URL: https://datasheet.ciiva.com/28694/1678782-28694219.pdf?src-supplier=Element14; ComponentLink2Description: https://datasheet.ciiva.com/28694/1678782-28694219.pdf?src-supplier=Element14; ComponentLink3URL: https://datasheet.ciiva.com/16772/70260748-16772570.pdf?src-supplier=Allied+Electronics; ComponentLink3Description: https://datasheet.ciiva.com/16772/70260748-16772570.pdf?src-supplier=Allied+Electronics; ComponentLink4URL: https://datasheet.ciiva.com/16766/70260748-16766262.pdf?src-supplier=Allied+Electronics; ComponentLink4Description: https://datasheet.ciiva.com/16766/70260748-16766262.pdf?src-supplier=Allied+Electronics; ComponentLink5URL: https://datasheet.ciiva.com/9117/aoa0000ce2-9117128.pdf?src-supplier=Avnet; ComponentLink5Description: https://datasheet.ciiva.com/9117/aoa0000ce2-9117128.pdf?src-supplier=Avnet; ComponentLink6URL: https://datasheet.ciiva.com/48531/aoa0000ce2-48531019.pdf?src-supplier=Avnet; ComponentLink6Description: https://datasheet.ciiva.com/48531/aoa0000ce2-48531019.pdf?src-supplier=Avnet; ComponentLink7URL: https://datasheet.ciiva.com/30095/aoa0000ce2-30095355.pdf?src-supplier=Onlinecomponents.com; ComponentLink7Description: https://datasheet.ciiva.com/30095/aoa0000ce2-30095355.pdf?src-supplier=Onlinecomponents.com; Parameter 1: *; JLCPCB Part #: C23185
R3 R79 = RES-2: ±1% ±100ppm/℃ 10kΩ 0.1W 0603 Chip Resistor - Surface Mount ROHS; Manufacturer: Yageo; Manufacturer Part Number: RC0603JR-071ML; Power Rating: 100mW; Resistance Tolerance: ±5%; Product Range: RCSeries; Temperature Coefficient: ±100ppm/°C; Resistor Element Type: ThickFilm; Resistance: 1Mohm; SVHC: ToBeAdvised; Voltage Rating: 50V; Resistor Case Style: 0603[1608Metric]; Tolerance: 5%; MSL: MSL1-Unlimited; Package Description: 2-Pin Surface Mount Device, Body 1.6 x 0.8 mm; Datasheet Version: Rev. 7, 05/2017; Datasheet URL: http://www.yageo.com/documents/recent/PYu-RC_Group_51_RoHS_L_7.pdf; Manufacturer URL: http://www.yageo.com/; Package Reference: 0603; Automotive Qualification Standard: -; Packaging: CutTape; Mounting Technology: SurfaceMount; Supplier 1: Digi-Key; Supplier Part Number 1: 311-1.0MGRCT-ND; Stock 1: 3949362; Pricing 1: 1=0,10000, 10=0,01900, 100=0,00770, 1000=0,00347, 2500=0,00301 (USD); RoHS: Yes; Case/Package: 0603; Number of Pins: 2; Case Code (Imperial): 0603; Case Code (Metric): 1608; Contact Plating: Tin,Matte; Min Operating Temperature: -55°C; Max Operating Temperature: 155°C; Composition: Thick Film; Termination: SMD/SMT; Package Quantity: 5000; Military Standard: Not; Voltage Rating (DC): 50V; Length: 1.6mm; Height: 0.45mm; Width: 0.8mm; Depth: 0.8mm; Radiation Hardening: No; Lead Free: Lead Free; REACH SVHC: No SVHC; ComponentLink1URL: https://datasheet.ciiva.com/46395/443971-46395067.pdf?src-supplier=Element14; ComponentLink1Description: https://datasheet.ciiva.com/46395/443971-46395067.pdf?src-supplier=Element14; ComponentLink2URL: https://datasheet.ciiva.com/8883/pyu-rc0603-51-rohs-l-4-8883053.pdf?src-supplier=Avnet; ComponentLink2Description: https://datasheet.ciiva.com/8883/pyu-rc0603-51-rohs-l-4-8883053.pdf?src-supplier=Avnet; ComponentLink3URL: https://datasheet.ciiva.com/12555/rc0603-272842-12555342.pdf?src-supplier=Mouser; ComponentLink3Description: https://datasheet.ciiva.com/12555/rc0603-272842-12555342.pdf?src-supplier=Mouser; ComponentLink4URL: https://datasheet.ciiva.com/7746/443971-7746463.pdf?src-supplier=Element14; ComponentLink4Description: https://datasheet.ciiva.com/7746/443971-7746463.pdf?src-supplier=Element14; Parameter 1: *; JLCPCB Part #: C25804
R25 R28 = CMP-2100-03663-1: Chip Resistor, 100 Ohm, +/- 1%, 0.1 W, -55 to 155 degC, 0603 (1608 Metric), RoHS, Tape and Reel; Manufacturer: Yageo; Manufacturer Part Number: RC0603FR-07100RL; Voltage Rating (DC): 50V; Power Rating: 100mW; Resistance: 100Ohm; Temperature Coefficient: 100ppm/degreesC; Number of Pins: 2; Tolerance: 1%; Height: 0.45mm; Manufacturer URL: http://www.yageo.com/; Military Standard: Not; Datasheet URL: http://www.yageo.com/NewPortal/yageodocoutput?fileName=/pdf/R-Chip/PYu-RC_Group_51_RoHS_L_5.pdf; Case Code (Imperial): 0603; Termination: SMD/SMT; Lead Free: LeadFree; Max Operating Temperature: 155degC; Case Code (Metric): 1608; RoHSCompliant: true; Voltage Rating: 50V; Width: 0.8mm; Composition: ThickFilm; Depth: 0.8mm; REACH SVHC: Unknown; Min Operating Temperature: -55degC; Packaging: TapeandReel; Package Description: 2-Pin Surface Mount Device, Body 1.6 x 0.8 mm; Length: 1.6mm; Package Reference: 0603; Datasheet Version: Rev. 5, 10/2016; Case/Package: 0603; Supplier 1: Digi-Key; Supplier Part Number 1: 311-100HRDKR-ND; RoHS: Yes; Category: Chip SMD Resistors; Stock 1: 21618328; Pricing 1: 1=0.10000, 10=0.02300, 100=0.00940, 1000=0.00421, 2500=0.00366 (USD); ComponentLink1URL: https://datasheet.ciiva.com/7660/38590-7660788.pdf?src-supplier=Element14; ComponentLink1Description: https://datasheet.ciiva.com/7660/38590-7660788.pdf?src-supplier=Element14; ComponentLink2URL: https://datasheet.ciiva.com/11808/0900766b80f96399-11808280.pdf?src-supplier=RSComponents; ComponentLink2Description: https://datasheet.ciiva.com/11808/0900766b80f96399-11808280.pdf?src-supplier=RSComponents; ComponentLink3URL: https://datasheet.ciiva.com/46440/1868787-46440890.pdf?src-supplier=Element14; ComponentLink3Description: https://datasheet.ciiva.com/46440/1868787-46440890.pdf?src-supplier=Element14; ComponentLink4URL: https://datasheet.ciiva.com/7746/1738695-7746237.pdf?src-supplier=Element14; ComponentLink4Description: https://datasheet.ciiva.com/7746/1738695-7746237.pdf?src-supplier=Element14; ComponentLink5URL: https://datasheet.ciiva.com/7746/1738695-7746238.pdf?src-supplier=Element14; ComponentLink5Description: https://datasheet.ciiva.com/7746/1738695-7746238.pdf?src-supplier=Element14; ComponentLink6URL: https://datasheet.ciiva.com/22747/443971-22747518.pdf?src-supplier=Element14; ComponentLink6Description: https://datasheet.ciiva.com/22747/443971-22747518.pdf?src-supplier=Element14; Parameter 1: *; JLCPCB Part #: *
R26 = CMP-2000-00702-1: ±1% ±200ppm/℃ 100Ω 0.1W 0603 Chip Resistor - Surface Mount ROHS; Manufacturer: Panasonic; Part Number: ERJ-3GEYJ101V; Parameter 1: *; JLCPCB Part #: C22775
R27 = RES: 18kΩ ±1% ±100ppm/℃ 0.1W 0603 Chip Resistor - Surface Mount ROHS; Manufacturer: Panasonic; Part Number: ERA3AEB183V; Manufacturer Part Number: ERA-3AEB183V; Resistance: 18kR; Power Rating: 100mW; Tolerance: 0.1%; Temperature Coefficient: 25ppm/°C; Voltage Rating (DC): 75V; Supplier 1: Newark; Supplier Part Number 1: 08N2107; RoHS: Yes; Category: Chip SMD Resistors; Stock 1: 2207; Pricing 1: 1=0.35700, 25=0.30700, 50=0.21600, 100=0.12400, 250=0.10000, 500=0.07500, 1000=0.05100 (USD); Mount: Surface Mount; Case/Package: 0603; Number of Pins: 2; Case Code (Metric): 1608; Case Code (Imperial): 0603; Contact Plating: Tin; Size Code: 0603; Min Operating Temperature: -55°C; Max Operating Temperature: 155°C; Packaging: Tape and Reel; Resistor Type: Thin Film; Number of Terminations: 2; Max Power Dissipation: 100mW; Series: ERA-3A; Voltage Rating: 75V; Package Quantity: 1; Termination: SMD/SMT; Features: Automotive AEC-Q200; Resistance Tolerance: 0.1%; Construction: Rectangular; Technology: METAL FILM; Length: 1.6mm; Width: 0.8mm; Height: 0.45mm; Depth: 0.8mm; Radiation Hardening: No; RoHS Compliant: Yes; Lead Free: Lead Free; REACH SVHC: No SVHC; Military Standard: Not; ComponentLink1URL: https://datasheet.ciiva.com/11808/0900766b80fe20f7-11808020.pdf?src-supplier=RSComponents; ComponentLink1Description: https://datasheet.ciiva.com/11808/0900766b80fe20f7-11808020.pdf?src-supplier=RSComponents; ComponentLink2URL: https://datasheet.ciiva.com/29183/451333-da-01-en-widerstand-0603-era-29183823.pdf?src-supplier=Conrad; ComponentLink2Description: https://datasheet.ciiva.com/29183/451333-da-01-en-widerstand-0603-era-29183823.pdf?src-supplier=Conrad; ComponentLink3URL: https://datasheet.ciiva.com/16395/aoa0000ce26-16395253.pdf?src-supplier=Future+Electronics; ComponentLink3Description: https://datasheet.ciiva.com/16395/aoa0000ce26-16395253.pdf?src-supplier=Future+Electronics; ComponentLink4URL: https://datasheet.ciiva.com/16764/70068849-16764837.pdf?src-supplier=Allied+Electronics; ComponentLink4Description: https://datasheet.ciiva.com/16764/70068849-16764837.pdf?src-supplier=Allied+Electronics; ComponentLink5URL: https://datasheet.ciiva.com/9117/aoa0000ce26-9117398.pdf?src-supplier=Avnet; ComponentLink5Description: https://datasheet.ciiva.com/9117/aoa0000ce26-9117398.pdf?src-supplier=Avnet; ComponentLink6URL: https://datasheet.ciiva.com/17211/aoa0000ce26-17211238.pdf?src-supplier=Avnet+Europe; ComponentLink6Description: https://datasheet.ciiva.com/17211/aoa0000ce26-17211238.pdf?src-supplier=Avnet+Europe; ComponentLink7URL: https://datasheet.ciiva.com/22739/485442-22739288.pdf?src-supplier=Element14; ComponentLink7Description: https://datasheet.ciiva.com/22739/485442-22739288.pdf?src-supplier=Element14; ComponentLink8URL: https://datasheet.ciiva.com/48425/era-eng-tds-48425433.pdf?src-supplier=Distrelec; ComponentLink8Description: https://datasheet.ciiva.com/48425/era-eng-tds-48425433.pdf?src-supplier=Distrelec; ComponentLink9URL: https://datasheet.ciiva.com/48530/era-eng-tds-48530218.pdf?src-supplier=Distrelec; ComponentLink9Description: https://datasheet.ciiva.com/48530/era-eng-tds-48530218.pdf?src-supplier=Distrelec; ComponentLink10URL: https://datasheet.ciiva.com/5860/485442-5860507.pdf?src-supplier=Farnell; ComponentLink10Description: https://datasheet.ciiva.com/5860/485442-5860507.pdf?src-supplier=Farnell; ComponentLink11URL: https://datasheet.ciiva.com/16771/70068849-16771099.pdf?src-supplier=Allied+Electronics; ComponentLink11Description: https://datasheet.ciiva.com/16771/70068849-16771099.pdf?src-supplier=Allied+Electronics; ComponentLink12URL: https://datasheet.ciiva.com/5860/485442-5860508.pdf?src-supplier=Farnell; ComponentLink12Description: https://datasheet.ciiva.com/5860/485442-5860508.pdf?src-supplier=Farnell; ComponentLink13URL: https://datasheet.ciiva.com/7944/485442-7944492.pdf?src-supplier=Element14; ComponentLink13Description: https://datasheet.ciiva.com/7944/485442-7944492.pdf?src-supplier=Element14; ComponentLink14URL: https://datasheet.ciiva.com/30234/54aoa0000ce26-30234638.pdf?src-supplier=Onlinecomponents.com; ComponentLink14Description: https://datasheet.ciiva.com/30234/54aoa0000ce26-30234638.pdf?src-supplier=Onlinecomponents.com; ComponentLink15URL: https://datasheet.ciiva.com/46422/485442-46422590.pdf?src-supplier=Element14; ComponentLink15Description: https://datasheet.ciiva.com/46422/485442-46422590.pdf?src-supplier=Element14; ComponentLink16URL: https://datasheet.ciiva.com/46422/485442-46422591.pdf?src-supplier=Element14; ComponentLink16Description: https://datasheet.ciiva.com/46422/485442-46422591.pdf?src-supplier=Element14; Parameter 1: *; JLCPCB Part #: C25810
R29 = CMP-2000-00271-1: ±1% 4.7kΩ ±100ppm/℃ 0.1W 0603 Chip Resistor - Surface Mount ROHS; Manufacturer: Panasonic; Part Number: ERJ-3EKF1602V; Parameter 1: *; JLCPCB Part #: C23162
R30 R141-R143 = CMP-2000-00874-1: Part Number: ERA-3AEB103V; Manufacturer: Panasonic; Parameter 1: *; JLCPCB Part #: *
R31 = CMP-2000-00798-1: ±1% 15kΩ ±100ppm/℃ 0.1W 0603 Chip Resistor - Surface Mount ROHS; Part Number: ERJ-3GEYJ474V; Manufacturer: Panasonic; Parameter 1: *; JLCPCB Part #: C22809
R39 R68 = CMP-2100-03667-1: ±1% 0Ω 0.1W 0603 Chip Resistor - Surface Mount ROHS; Manufacturer: Yageo; Temperature Coefficient: 200ppm/degreesC; Tolerance: 5%; Voltage Rating: 50V; Power Rating: 100mW; Resistance: 0mOhm; Width: 0.8mm; Max Operating Temperature: 155degC; Package Reference: 0603; Height: 0.45mm; Depth: 0.8mm; Package Description: 2-Pin Surface Mount Device, Body 1.6 x 0.8 mm; Termination: SMD/SMT; Package Quantity: 5000; Case/Package: 0603; Case Code (Imperial): 0603; Radiation Hardening: No; Number of Pins: 2; Length: 1.6mm; Lead Free: LeadFree; Voltage Rating (DC): 50V; Military Standard: Not; Datasheet URL: http://www.yageo.com/NewPortal/yageodocoutput?fileName=/pdf/R-Chip/PYu-RC_Group_51_RoHS_L_5.pdf; Manufacturer URL: http://www.yageo.com/; Packaging: TapeandReel; Case Code (Metric): 1608; Min Operating Temperature: -55degC; Composition: ThickFilm; RoHSCompliant: true; Contact Plating: Tin; Datasheet Version: Rev. 5, 10/2016; REACH SVHC: NoSVHC; Parameter 1: *; JLCPCB Part #: C21189